# Altium schematic sheet STMCamera21.SchDoc
size A; SheetNumber: 1; SheetTotal: 1
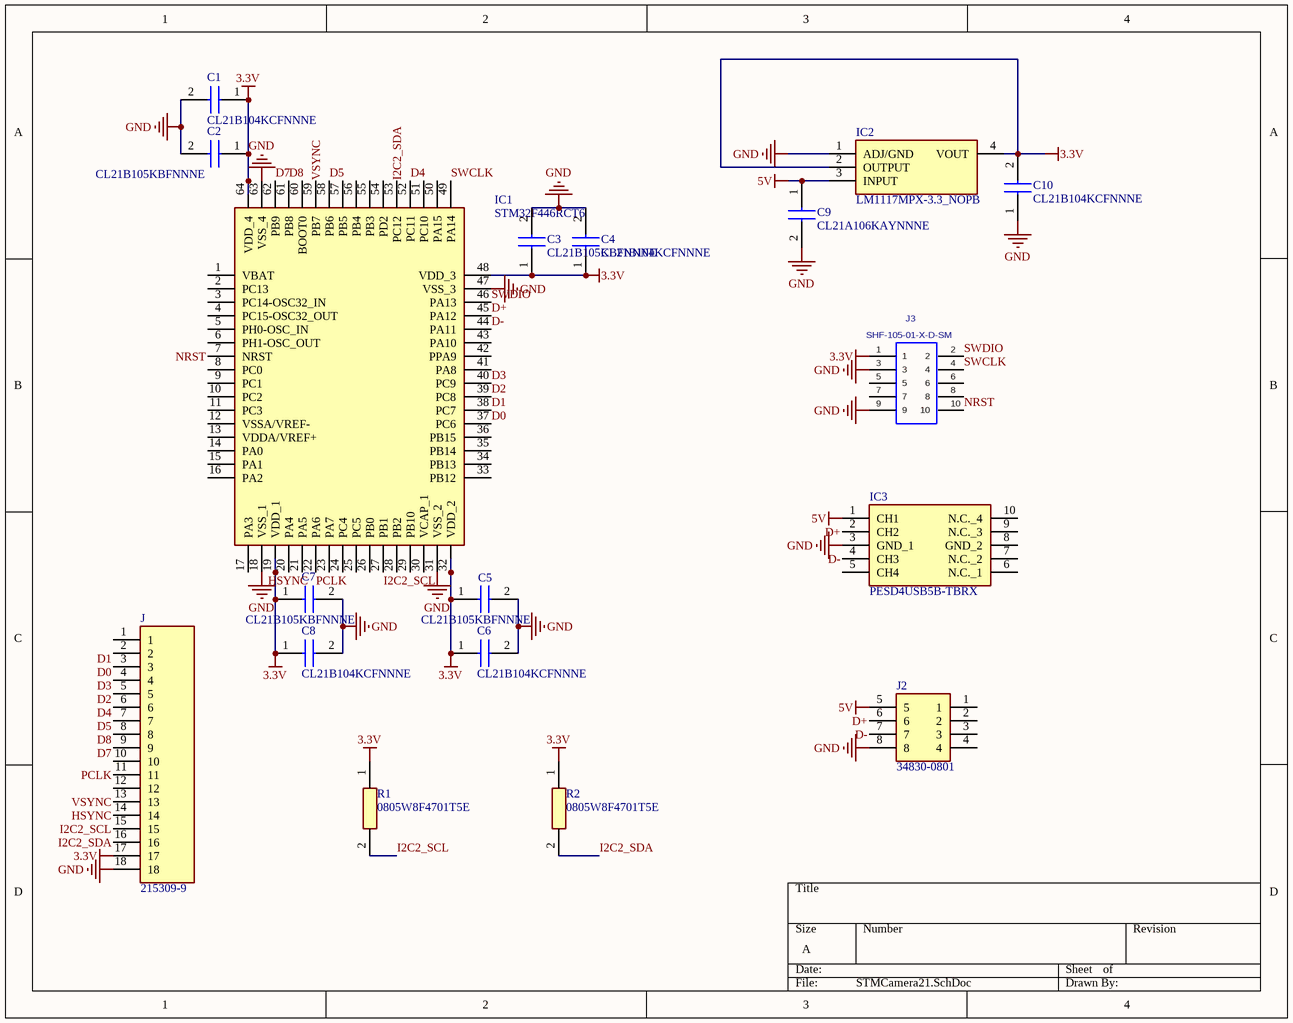
[diagram p0: STMCamera21.SchDoc]

## Parts
C1  CL21B104KCFNNNE  [CAPC2012X135N]
C2  CL21B105KBFNNNE  [CAPC2012X135N]
C3  CL21B105KBFNNNE  [CAPC2012X135N]
C4  CL21B104KCFNNNE  [CAPC2012X135N]
C5  CL21B105KBFNNNE  [CAPC2012X135N]
C6  CL21B104KCFNNNE  [CAPC2012X135N]
C7  CL21B105KBFNNNE  [CAPC2012X135N]
C8  CL21B104KCFNNNE  [CAPC2012X135N]
C9  CL21A106KAYNNNE  [CAPC2012X145N]
C10  CL21B104KCFNNNE  [CAPC2012X135N]
IC1  STM32F446RCT6  [QFP50P1200X1200X160-64N]
IC2  LM1117MPX-3.3_NOPB  [SOT230P700X180-4N]
IC3  PESD4USB5B-TBRX  [PESD4USB5BTBRX]
J  215309-9  [TE_215309-9]
J2  34830-0801  [348300801]
J3  SHF-105-01-X-D-SM  [SHF-105-01-X-D-SM]
R1  0805W8F4701T5E  [TNPV0805180KBEEA]
R2  0805W8F4701T5E  [TNPV0805180KBEEA]

## Nets
3.3V: C1.1 C2.1 C3.1 C4.1 C5.1 C6.1 C7.1 C8.1 C10.2 IC1.19(VDD_1) IC1.32(VDD_2) IC1.48(VDD_3) IC1.64(VDD_4) IC2.2(OUTPUT) IC2.4(VOUT) J.17 J3.1 R1.1 R2.1
5V: C9.1 IC2.3(INPUT) IC3.1(CH1) J2.5
GND: C1.2 C2.2 C3.2 C4.2 C5.2 C6.2 C7.2 C8.2 C9.2 C10.1 IC1.18(VSS_1) IC1.31(VSS_2) IC1.47(VSS_3) IC1.63(VSS_4) IC2.1(ADJ/GND) IC3.3(GND_1) J.18 J2.8 J3.3 J3.9
D0: IC1.37(PC6) J.4
D1: IC1.38(PC7) J.3
D2: IC1.39(PC8) J.6
D3: IC1.40(PC9) J.5
D4: IC1.52(PC11) J.7
D5: IC1.58(PB6) J.8
D7: IC1.62(PB9) J.10
D8: IC1.61(PB8) J.9
D+: IC1.45(PA12) IC3.2(CH2) J2.6
D-: IC1.44(PA11) IC3.4(CH3) J2.7
HSYNC: IC1.20(PA4) J.14
I2C2_SCL: IC1.29(PB10) J.15 R1.2
I2C2_SDA: IC1.53(PC12) J.16 R2.2
NRST: IC1.7(NRST) J3.10
PCLK: IC1.22(PA6) J.11
SWCLK: IC1.49(PA14) J3.4
SWDIO: IC1.46(PA13) J3.2
VSYNC: IC1.59(PB7) J.13

Not connected (* = marked no-connect by the designer): IC1 1(VBAT) 2(PC13) 3(PC14-OSC32_IN) 4(PC15-OSC32_OUT) 5(PH0-OSC_IN) 6(PH1-OSC_OUT) 8(PC0) 9(PC1) 10(PC2) 11(PC3) 12(VSSA/VREF-) 13(VDDA/VREF+) 14(PA0) 15(PA1) 16(PA2) 17(PA3) 21(PA5) 23(PA7) 24(PC4) 25(PC5) 26(PB0) 27(PB1) 28(PB2) 30(VCAP_1) 33(PB12) 34(PB13) 35(PB14) 36(PB15) 41(PA8) 42(PPA9) 43(PA10) 50(PA15) 51(PC10) 54(PD2) 55(PB3) 56(PB4) 57(PB5) 60(BOOT0); IC3 5(CH4) 6(N.C._1) 7(N.C._2) 8(GND_2) 9(N.C._3) 10(N.C._4); J 1 2 12; J2 1 2 3 4; J3 5 6 7 8

## Library data of the parts
C1 C4 C6 C8 C10 = CL21B104KCFNNNE: 100uF; Manufacturer_Name: Samsung Electro-Mechanics; Datasheet Link: https://datasheet.datasheetarchive.com/originals/distributors/DKDS-19/374389.pdf; Height: 1.35mm; Manufacturer_Part_Number: CL21B104KCFNNNE; Mouser Part Number: 187-CL21B104KCFNNNE; Mouser Price/Stock: https://www.mouser.co.uk/ProductDetail/Samsung-Electro-Mechanics/CL21B104KCFNNNE?qs=lptGheUA4EwiEGVRX9oguw%3D%3D; Arrow Part Number: CL21B104KCFNNNE; Arrow Price/Stock: https://www.arrow.com/en/products/cl21b104kcfnnne/samsung-electro-mechanics
C2 C3 C5 C7 = CL21B105KBFNNNE: 1uF; Manufacturer_Name: Samsung Electro-Mechanics; Datasheet Link: https://componentsearchengine.com/Datasheets/2/CL21B105KBFNNNE.pdf; Height: 1.35mm; Manufacturer_Part_Number: CL21B105KBFNNNE; Mouser Part Number: 187-CL21B105KBFNNNE; Mouser Price/Stock: https://www.mouser.co.uk/ProductDetail/Samsung-Electro-Mechanics/CL21B105KBFNNNE?qs=yOVawPpwOwmddQEBPU6Y9A%3D%3D; Arrow Part Number: CL21B105KBFNNNE; Arrow Price/Stock: https://www.arrow.com/en/products/cl21b105kbfnnne/samsung-electro-mechanics?region=europe
C9 = CL21A106KAYNNNE: 10uF; Manufacturer_Name: Samsung Electro-Mechanics; Datasheet Link: https://datasheet.datasheetarchive.com/originals/distributors/Datasheets_SAMA/6a45835c9b7400e9b49c55c38a8ff4a2.pdf; Height: 1.45mm; Manufacturer_Part_Number: CL21A106KAYNNNE; Mouser Part Number: 187-CL21A106KAYNNNE; Mouser Price/Stock: https://www.mouser.co.uk/ProductDetail/Samsung-Electro-Mechanics/CL21A106KAYNNNE?qs=yOVawPpwOwmTXAd4dJtNjA%3D%3D; Arrow Part Number: CL21A106KAYNNNE; Arrow Price/Stock: https://www.arrow.com/en/products/cl21a106kaynnne/samsung-electro-mechanics?region=nac
IC1 = STM32F446RCT6: Integrated Circuit; Manufacturer_Name: STMicroelectronics; Datasheet Link: http://www.st.com/content/ccc/resource/technical/document/datasheet/65/cb/75/50/53/d6/48/24/DM00141306.pdf/files/DM00141306.pdf/jcr:content/translations/en.DM00141306.pdf; Height: 1.6mm; Manufacturer_Part_Number: STM32F446RCT6; Mouser Part Number: 511-STM32F446RCT6; Mouser Price/Stock: https://www.mouser.co.uk/ProductDetail/STMicroelectronics/STM32F446RCT6?qs=Ok1pvOkw6%2FrlZ63GppV%2FkA%3D%3D; Arrow Part Number: STM32F446RCT6; Arrow Price/Stock: https://www.arrow.com/en/products/stm32f446rct6/stmicroelectronics?region=nac
IC2 = LM1117MPX-3.3_NOPB: Integrated Circuit; Manufacturer_Name: Texas Instruments; Manufacturer_Part_Number: LM1117MPX-3.3/NOPB; Datasheet Link: http://www.ti.com/lit/ds/symlink/lm1117.pdf; Height: 1.8mm; Mouser Part Number: 926-LM1117MPX3.3NOPB; Mouser Price/Stock: https://www.mouser.co.uk/ProductDetail/Texas-Instruments/LM1117MPX-3.3-NOPB?qs=X1J7HmVL2ZHRbBIxXi4utg%3D%3D; Arrow Part Number: LM1117MPX-3.3/NOPB; Arrow Price/Stock: https://www.arrow.com/en/products/lm1117mpx-3.3nopb/texas-instruments?region=nac
IC3 = PESD4USB5B-TBRX: Integrated Circuit; Manufacturer_Name: Nexperia; Datasheet Link: https://assets.nexperia.com/documents/data-sheet/PESD4USB5B-TBS.pdf; Height: 0.8mm; Manufacturer_Part_Number: PESD4USB5B-TBRX; Mouser Part Number: 771-PESD4USB5B-TBRX; Mouser Price/Stock: https://www.mouser.co.uk/ProductDetail/Nexperia/PESD4USB5B-TBRX?qs=MyNHzdoqoQL1Wz6R0ceOBw%3D%3D
J = 215309-9: 2X9P HV100 REC CON. TE, 8.5MM; Number_of_Positions: 9; Centerline_Pitch: 2.54 mm[.1 in]; MF: TE Connectivity; Product_Type: Connector; Package: None; Availability: Unavailable; TE_purchase_URL: https://www.te.com/usa-en/product-215309-9.html?te_bu=Cor&te_type=disp&te_campaign=seda_glo_cor-seda-global-disp-prtnr-fy19-seda-model-bom-cta_sma-317_1&elqCampaignId=32493; EU_RoHS_Compliance: Compliant; MP: 215309-9; SnapEDA_Link: https://www.snapeda.com/parts/215309-9/TE%20Connectivity%20AMP%20Connectors/view-part/1389782/?ref=snap; Price: None; Value: *
J2 = 34830-0801: Connector; Manufacturer_Name: Molex; Datasheet Link: https://www.mouser.com/datasheet/2/276/0348300801_PCB_HEADERS-693677.pdf; Height: 25.88mm; Manufacturer_Part_Number: 34830-0801; Mouser Part Number: 538-34830-0801; Mouser Price/Stock: https://www.mouser.co.uk/ProductDetail/Molex/34830-0801?qs=PdnAIJ6Mlf2HM0lerKt%252BjA%3D%3D
J3 = SHF-105-01-X-D-SM: 0.05"X0.05" SHROUDED TERMINAL STRIP, 10 PINS.; MANUFACTURER: SAMTEC; CREATED: February 17, 2015 - Wendy Xin; PCB DECAL: SHF-105-01-X-D-SM
R1 R2 = TNPV0805180KBEEA: 4.7k; Manufacturer_Name: Vishay; Datasheet Link: https://www.vishay.com/docs/28881/tnpve3.pdf; Height: 0.55mm; Manufacturer_Part_Number: TNPV0805180KBEEA; Mouser Part Number: 71-TNPV0805180KBEEA; Mouser Price/Stock: https://www.mouser.co.uk/ProductDetail/Vishay/TNPV0805180KBEEA?qs=Li%252BoUPsLEnuke%2FRX4njE1w%3D%3D